# Altium schematic sheet EE579_Skittles_sch.SchDoc
size A4; SheetNumber: 1; SheetTotal: 1
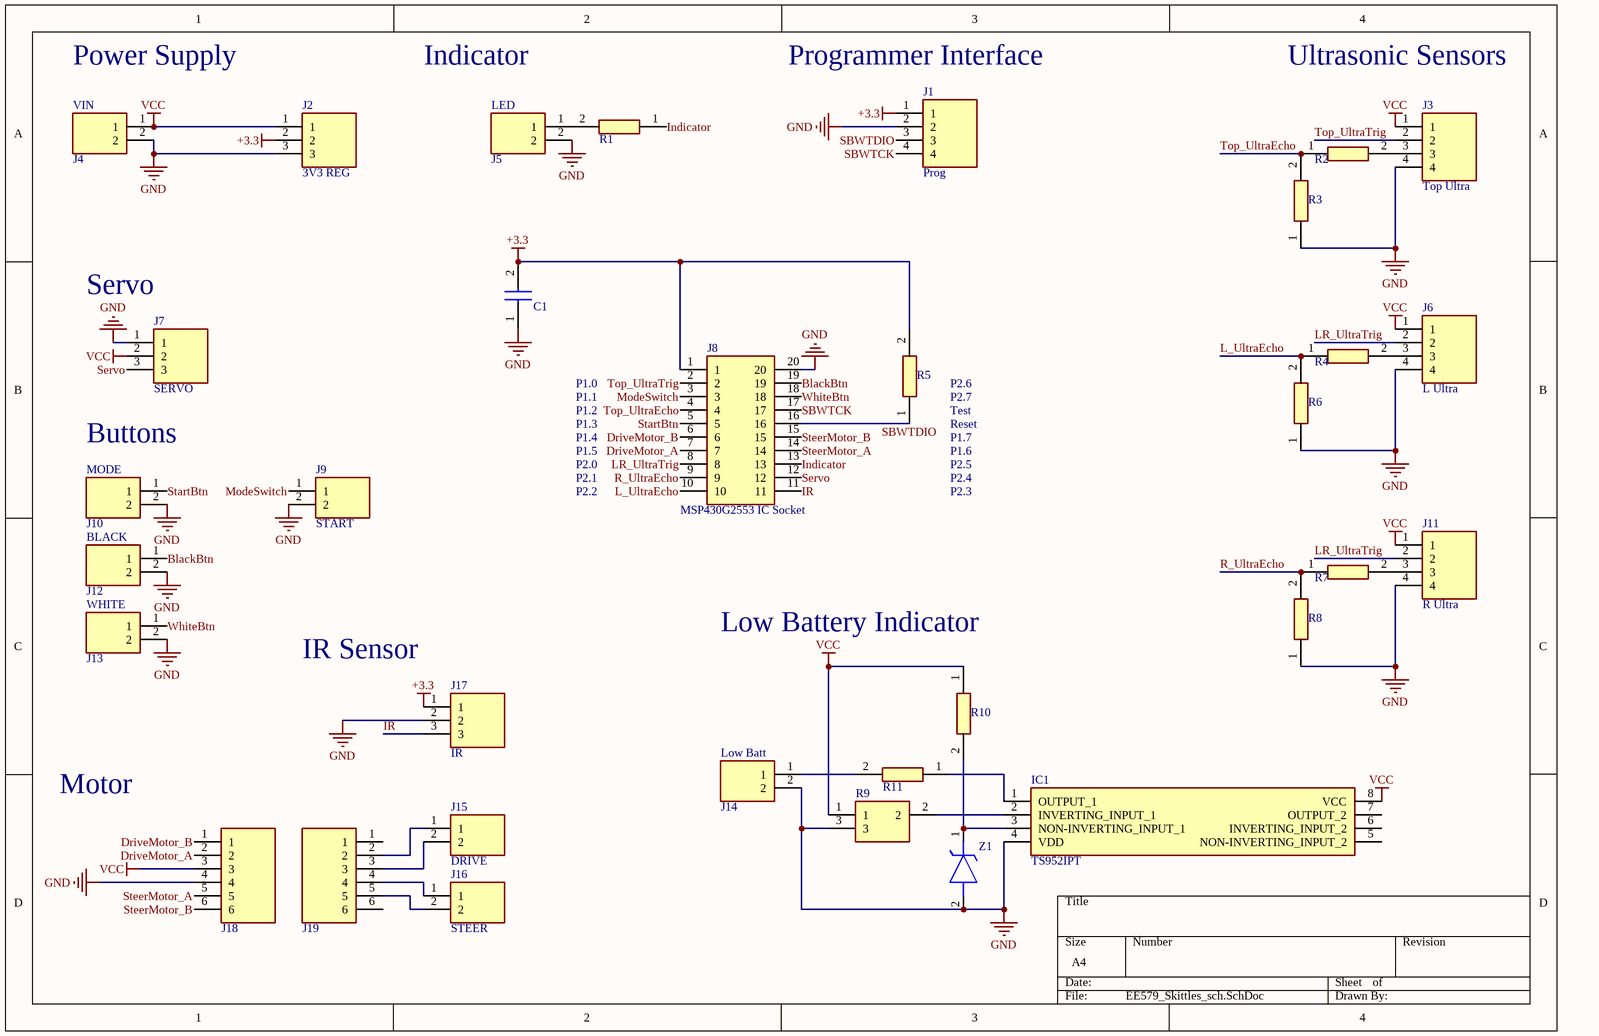
[diagram p0: EE579_Skittles_sch.SchDoc]

## Parts
C1  21A106KQFNNNG  [CAPC2012X135N]  (value not drawn)
IC1  TS952IPT  [SOP65P640X120-8N]
J1  Prog  [HDRV4W64P0X254_1X4_1016X250X901P]
J2  3V3 REG  [RHDR3W60P0X254_1X3_762X254X700P]
J3  Top Ultra  [SHDR4W50P0X200_1X4_990X450X600P]
J4  VIN  [SHDR2W50P0X200_1X2_590X450X600P]
J5  LED  [SHDR2W50P0X200_1X2_590X450X600P]
J6  L Ultra  [SHDR4W50P0X200_1X4_990X450X600P]
J7  SERVO  [RHDR3W60P0X254_1X3_762X254X700P]
J8  MSP430G2553 IC Socket  [DIPS762W70P254L2540H510Q20N]
J9  START  [SHDR2W50P0X200_1X2_590X450X600P]
J10  MODE  [SHDR2W50P0X200_1X2_590X450X600P]
J11  R Ultra  [SHDR4W50P0X200_1X4_990X450X600P]
J12  BLACK  [SHDR2W50P0X200_1X2_590X450X600P]
J13  WHITE  [SHDR2W50P0X200_1X2_590X450X600P]
J14  Low Batt  [SHDR2W50P0X200_1X2_590X450X600P]
J15  DRIVE  [SHDR2W50P0X200_1X2_590X450X600P]
J16  STEER  [SHDR2W50P0X200_1X2_590X450X600P]
J17  IR  [SHDR3W50P0X200_1X3_790X450X600P]
J18  61300611821  [RHDR6W97P0X254_1X6_1574X250X865P]  (value not drawn)
J19  61300611821  [RHDR6W97P0X254_1X6_1574X250X865P]  (value not drawn)
R1  ERJ-PB6B3002V  [RESC2012X70N]  (value not drawn)
R2  ERJ-PB6B3002V  [RESC2012X70N]  (value not drawn)
R3  ERJ-PB6B3002V  [RESC2012X70N]  (value not drawn)
R4  ERJ-PB6B3002V  [RESC2012X70N]  (value not drawn)
R5  ERJ-PB6B3002V  [RESC2012X70N]  (value not drawn)
R6  ERJ-PB6B3002V  [RESC2012X70N]  (value not drawn)
R7  ERJ-PB6B3002V  [RESC2012X70N]  (value not drawn)
R8  ERJ-PB6B3002V  [RESC2012X70N]  (value not drawn)
R9  3314G-1-103E  [3314G-1-102E]  (value not drawn)
R10  ERJ-PB6B3002V  [RESC2012X70N]  (value not drawn)
R11  ERJ-PB6B3002V  [RESC2012X70N]  (value not drawn)
Z1  BZT52C4V7-E3-08  [SOD3716X135N]  (value not drawn)

## Nets
+3.3: C1.2 J1.1 J2.2 J8.1 J17.1 R5.2
GND: C1.1 IC1.4(VDD) J1.2 J2.3 J3.4 J4.2 J5.2 J6.4 J7.1 J8.20 J9.2 J10.2 J11.4 J12.2 J13.2 J14.2 J17.2 J18.4 R3.1 R6.1 R8.1 R9.3 Z1.2(A)
VCC: IC1.8(VCC) J2.1 J3.1 J4.1 J6.1 J7.2 J11.1 J18.3 R9.1 R10.1
BlackBtn: J8.19 J12.1
DriveMotor_A: J8.7 J18.2
DriveMotor_B: J8.6 J18.1
Indicator: J8.13 R1.1
IR: J8.11 J17.3
L_UltraEcho: J8.10 R4.1 R6.2
LR_UltraTrig: J6.2 J8.8 J11.2
ModeSwitch: J8.3 J9.1
R_UltraEcho: J8.9 R7.1 R8.2
SBWTCK: J1.4 J8.17
SBWTDIO: J1.3 J8.16 R5.1
Servo: J7.3 J8.12
StartBtn: J8.5 J10.1
SteerMotor_A: J8.14 J18.5
SteerMotor_B: J8.15 J18.6
Top_UltraEcho: J8.4 R2.1 R3.2
Top_UltraTrig: J3.2 J8.2
WhiteBtn: J8.18 J13.1
NetIC1_1: IC1.1(OUTPUT_1) R11.1
NetIC1_2: IC1.2(INVERTING_INPUT_1) R9.2
NetIC1_3: IC1.3(NON-INVERTING_INPUT_1) R10.2 Z1.1(K)
NetJ3_3: J3.3 R2.2
NetJ5_1: J5.1 R1.2
NetJ6_3: J6.3 R4.2
NetJ11_3: J11.3 R7.2
NetJ14_1: J14.1 R11.2
NetJ15_1: J15.1 J19.2
NetJ15_2: J15.2 J19.3
NetJ16_1: J16.1 J19.4
NetJ16_2: J16.2 J19.5

Not connected (* = marked no-connect by the designer): IC1 5(NON-INVERTING_INPUT_2) 6(INVERTING_INPUT_2) 7(OUTPUT_2); J19 1 6

## Notes on the sheet
- Power Supply
- Indicator
- (near J1) Programmer Interface
- Ultrasonic Sensors
- (near J7) Servo
- P1.0
- (near R5) P2.6
- Buttons
- P1.1
- P1.2
- P1.3
- P1.4
- P1.5
- P1.6
- (near R5) P1.7
- (near R5) P2.7
- (near R5) Test
- (near R5) Reset
- P2.0
- P2.1
- P2.2
- P2.3
- P2.4
- P2.5
- Low Battery Indicator
- (near J17) IR Sensor
- Motor

## Library data of the parts
C1 = CL21A106KQFNNNG: Capacitor; Manufacturer_Name: SAMSUNG; Datasheet Link: https://octopart.com/cl21a106kpfnnne-samsung-9301557?gclid=EAIaIQobChMIppmoo53d5wIV14XVCh0LRA8uEAAYAiAAEgJJyPD_BwE; Height: 1.35mm; Manufacturer_Part_Number: CL21A106KQFNNNG; Mouser Part Number: 187-CL21A106KQFNNNG; Mouser Price/Stock: https://www.mouser.co.uk/ProductDetail/Samsung-Electro-Mechanics/CL21A106KQFNNNG?qs=hqM3L16%252Bxle4yU%252BqidqWig%3D%3D; Arrow Part Number: CL21A106KQFNNNG; Arrow Price/Stock: https://www.arrow.com/en/products/cl21a106kqfnnng/samsung-electro-mechanics?region=nac
IC1 = TS952IPT: Integrated Circuit; Manufacturer_Name: STMicroelectronics; Datasheet Link: https://4donline.ihs.com/images/VipMasterIC/IC/SGST/SGST-S-A0000954157/SGST-S-A0000803870-1.pdf?hkey=52A5661711E402568146F3353EA87419; Height: 1.2mm; Manufacturer_Part_Number: TS952IPT; Mouser Part Number: 511-TS952IP; Mouser Price/Stock: https://www.mouser.co.uk/ProductDetail/STMicroelectronics/TS952IPT?qs=FhojHmVgQovQNpIMuhf0yA%3D%3D; Arrow Part Number: TS952IPT; Arrow Price/Stock: https://www.arrow.com/en/products/ts952ipt/stmicroelectronics
J1 = PH1-04-UA: Connector; Manufacturer_Name: Adam Tech; Datasheet Link: https://datasheet.datasheetarchive.com/originals/distributors/Datasheets_SAMA/22522227e000bb8d8f26a3580c1bb98b.pdf; Height: 9.008mm; Manufacturer_Part_Number: PH1-04-UA; Mouser Part Number: 737-PH1-04-UA; Mouser Price/Stock: https://www.mouser.co.uk/ProductDetail/Adam-Tech/PH1-04-UA?qs=HoCaDK9Nz5fnp3pp8iwrSQ%3D%3D; Arrow Part Number: PH1-04-UA; Arrow Price/Stock: https://www.arrow.com/en/products/ph1-04-ua/adam-tech?region=nac
J2 J7 = 801-87-003-10-001101: Connector; Manufacturer_Name: Preci-Dip; Datasheet Link: http://www.precidip.com/en/Products/PCB-Connectors/pview/801-PP-NNN-10-001101.html; Height: 7mm; Manufacturer_Part_Number: 801-87-003-10-001101; Mouser Part Number: 437-8018700310001101; Mouser Price/Stock: https://www.mouser.co.uk/ProductDetail/Preci-dip/801-87-003-10-001101?qs=FtMuP6KVi2T66jAxB5rZkg%3D%3D; Arrow Part Number: 801-87-003-10-001101; Arrow Price/Stock: https://www.arrow.com/en/products/801-87-003-10-001101/preci-dip-sa
J3 J6 J11 = B4B-PH-K-S_LF__SN_: Connector; Manufacturer_Name: JST (JAPAN SOLDERLESS TERMINALS); Manufacturer_Part_Number: B4B-PH-K-S(LF)(SN); Datasheet Link: https://datasheet.lcsc.com/szlcsc/JST-Sales-America-B4B-PH-K-S-LF-SN_C131334.pdf; Height: 6mm; Arrow Part Number: B4B-PH-K-S(LF)(SN); Arrow Price/Stock: https://www.arrow.com/en/products/b4b-ph-k-s-lf-sn/jst-manufacturing?region=europe
J4 J5 J9 J10 J12-J16 = B2B-PH-K-S_LF__SN_: Connector; Manufacturer_Name: JST (JAPAN SOLDERLESS TERMINALS); Manufacturer_Part_Number: B2B-PH-K-S(LF)(SN); Datasheet Link: https://datasheet.lcsc.com/szlcsc/JST-Sales-America-B2B-PH-K-S-LF-SN_C131337.pdf; Height: 6mm; Arrow Part Number: B2B-PH-K-S(LF)(SN); Arrow Price/Stock: https://www.arrow.com/en/products/b2b-ph-k-s-lf-sn/jst-manufacturing?region=europe
J8 = 1-2199298-6: Connector; Manufacturer_Name: TE Connectivity; Datasheet Link: https://www.te.com/commerce/DocumentDelivery/DDEController?Action=showdoc&DocId=Customer+Drawing%7F2199298%7FA%7Fpdf%7FEnglish%7FENG_CD_2199298_A_baseFilename.pdf%7F1-2199298-6; Height: 5.1mm; Manufacturer_Part_Number: 1-2199298-6; Mouser Part Number: 571-1-2199298-6; Mouser Price/Stock: https://www.mouser.co.uk/ProductDetail/TE-Connectivity/1-2199298-6?qs=fK8dlpkaUMvuMXpJTs4GlA%3D%3D; Arrow Part Number: 1-2199298-6; Arrow Price/Stock: https://www.arrow.com/en/products/1-2199298-6/te-connectivity?region=europe
J17 = B3B-PH-K-S_LF__SN_: Connector; Manufacturer_Name: JST (JAPAN SOLDERLESS TERMINALS); Manufacturer_Part_Number: B3B-PH-K-S(LF)(SN); Datasheet Link: http://www.jst-mfg.com/product/pdf/eng/ePH.pdf; Height: 6mm; Arrow Part Number: B3B-PH-K-S(LF)(SN); Arrow Price/Stock: https://www.arrow.com/en/products/b3b-ph-k-s-lf-sn/jst-manufacturing?region=europe
J18 J19 = 61300611821: Connector; Manufacturer_Name: Wurth Elektronik; Datasheet Link: https://www.we-online.de/katalog/datasheet/61300611821.pdf; Height: 8.65mm; Manufacturer_Part_Number: 61300611821; Mouser Part Number: 710-61300611821; Mouser Price/Stock: https://www.mouser.co.uk/ProductDetail/Wurth-Elektronik/61300611821?qs=iLbezkQI%252BsgS21jF2eozhA%3D%3D
R1-R8 R10 R11 = ERJ-PB6B3002V: Resistor; Manufacturer_Name: Panasonic; Datasheet Link: https://componentsearchengine.com/Datasheets/1/ERJ-PB6B3002V.pdf; Height: 0.7mm; Manufacturer_Part_Number: ERJ-PB6B3002V; Mouser Part Number: 667-ERJ-PB6B3002V; Mouser Price/Stock: https://www.mouser.co.uk/ProductDetail/Panasonic/ERJ-PB6B3002V?qs=eFOtW6xYNWHxFAxx7HWdpg%3D%3D; Arrow Part Number: ERJ-PB6B3002V; Arrow Price/Stock: https://www.arrow.com/en/products/erj-pb6b3002v/panasonic?region=nac
R9 = 3314G-1-103E: Resistor; Manufacturer_Name: Bourns; Datasheet Link: https://componentsearchengine.com/Datasheets/2/3314G-1-103E.pdf; Manufacturer_Part_Number: 3314G-1-103E; Mouser Part Number: 652-3314G-1-103E; Mouser Price/Stock: https://www.mouser.co.uk/ProductDetail/Bourns/3314G-1-103E?qs=5DXzRwmrLHHE6mxfh4g4uw%3D%3D; Arrow Part Number: 3314G-1-103E; Arrow Price/Stock: https://www.arrow.com/en/products/3314g-1-103e/bourns?region=europe
Z1 = BZT52C4V7-E3-08: Zener Diode; Manufacturer_Name: Vishay; Datasheet Link: https://www.arrow.com/en/products/bzt52c4v7-e3-08/vishay; Height: 1.35mm; Manufacturer_Part_Number: BZT52C4V7-E3-08; Mouser Part Number: 78-BZT52C4V7-E3-08; Mouser Price/Stock: https://www.mouser.co.uk/ProductDetail/Vishay-Semiconductors/BZT52C4V7-E3-08?qs=KP8Io%2FXyE5QGkCdlrdvYmA%3D%3D; Arrow Part Number: BZT52C4V7-E3-08; Arrow Price/Stock: https://www.arrow.com/en/products/bzt52c4v7-e3-08/vishay